# EAGLE design Qwiic-OpenLog (EAGLE 9.1.2)
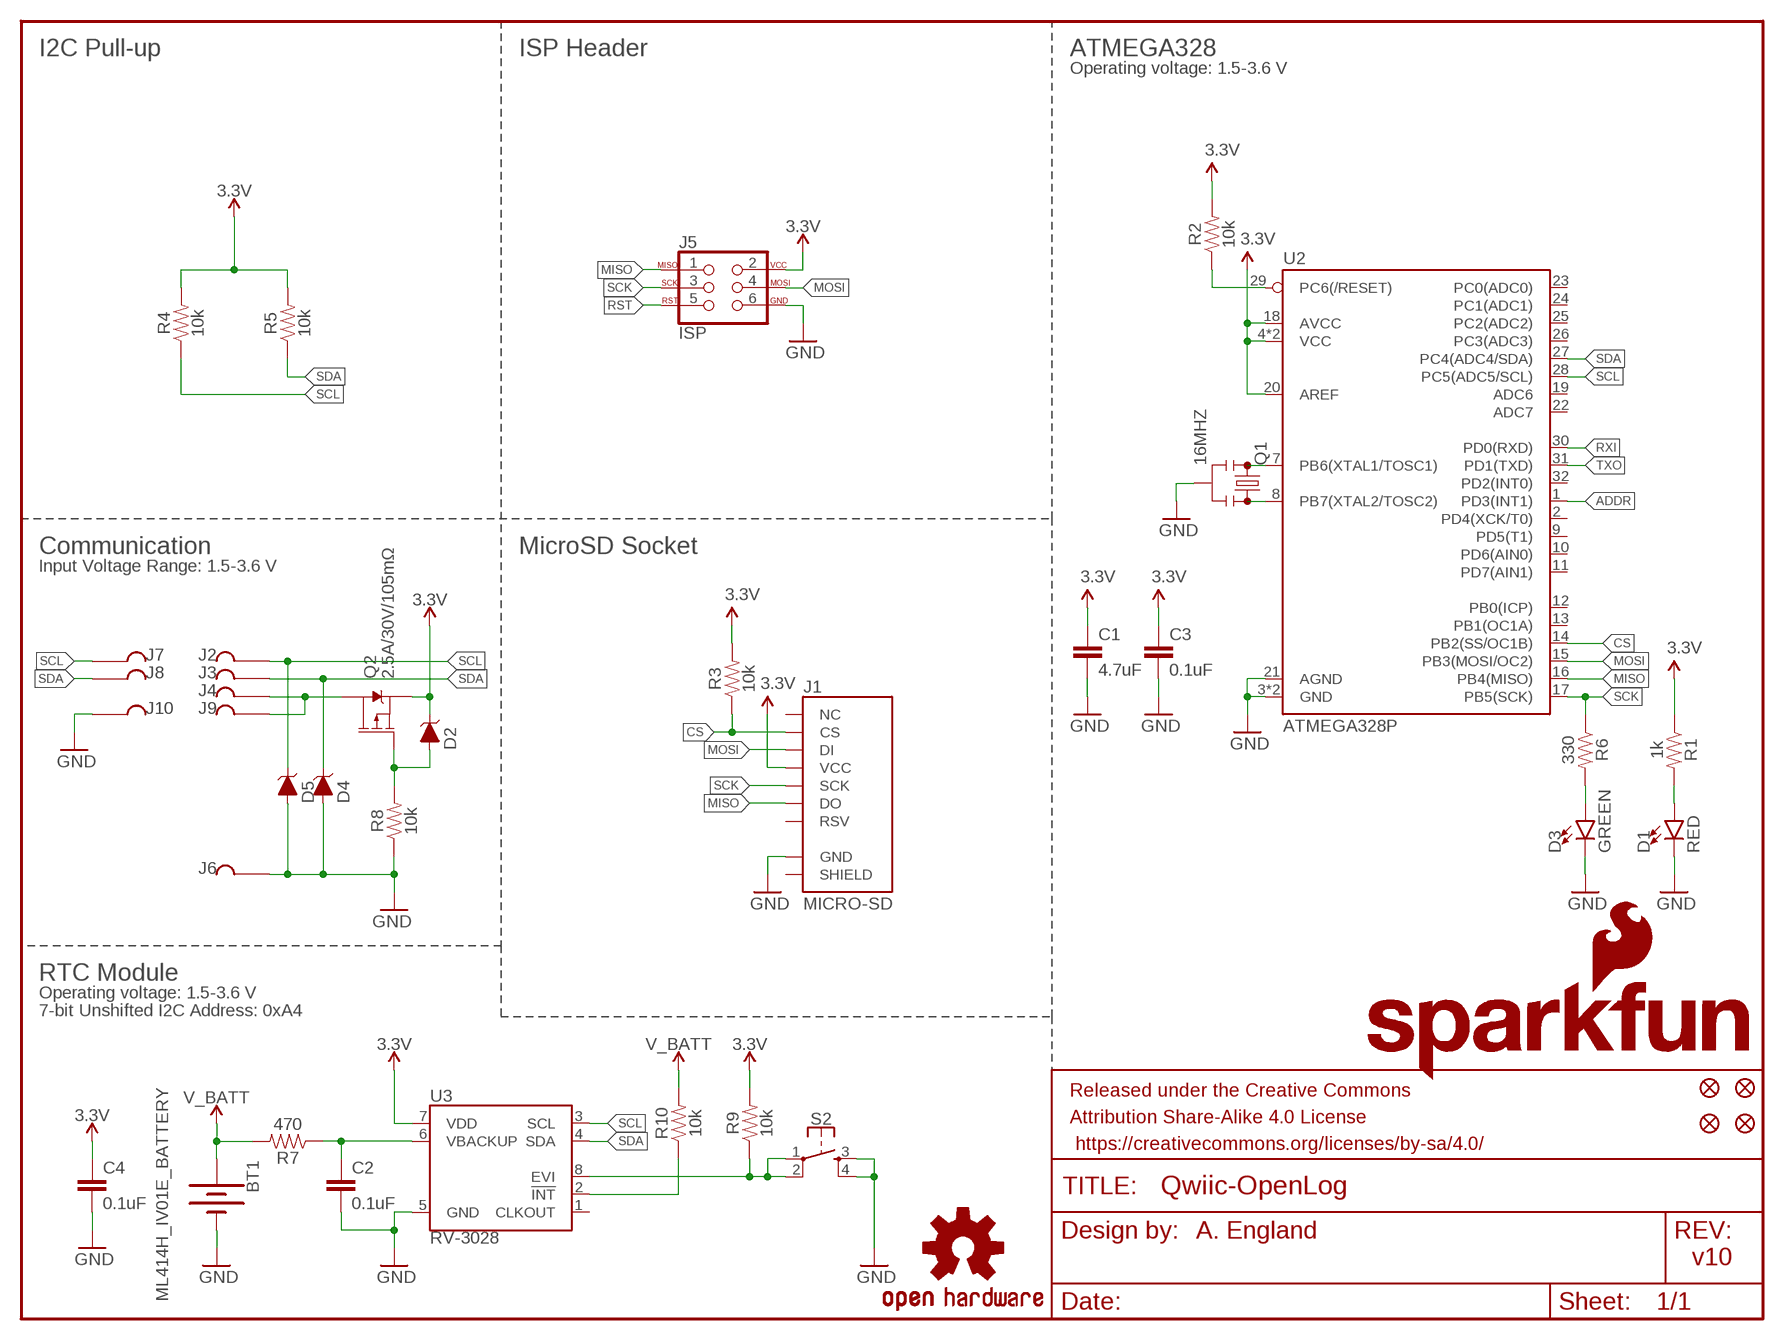
[diagram p0: schematic, sheet 1]

## Parts
BT1  ML414H_IV01E_BATTERY  [ML414H_IV01E]
C1  4.7uF  4.7UF-0603-6.3V-(10%)  [0603]
C2  0.1uF  0.1UF-0603-25V-(+80/-20%)  [0603]
C3  0.1uF  0.1UF-0603-25V-(+80/-20%)  [0603]
C4  0.1uF  0.1UF-0603-25V-(+80/-20%)  [0603]
D1  RED  LED-RED0603  [LED-0603]
D2  3.6V  DIODE-ZENER-BZT52C3V6S  [SOD-323]
D3  GREEN  LED-GREEN0603  [LED-0603]
D4  3.6V  DIODE-ZENER-BZT52C3V6S  [SOD-323]
D5  3.6V  DIODE-ZENER-BZT52C3V6S  [SOD-323]
FID1  FIDUCIALUFIDUCIAL  [FIDUCIAL-MICRO]
FID2  FIDUCIALUFIDUCIAL  [FIDUCIAL-MICRO]
FID3  FIDUCIALUFIDUCIAL  [FIDUCIAL-MICRO]
FID4  FIDUCIALUFIDUCIAL  [FIDUCIAL-MICRO]
FRAME1  FRAME-LETTER  [CREATIVE_COMMONS]
J1  MICRO-SD  MICRO-SD_CARD_SOCKETPUSH-PUSH  [MICRO-SD-SOCKET]
J2  GATORGATOR_MINI  [GATOR_MINI]
J3  GATORGATOR_MINI  [GATOR_MINI]
J4  GATORGATOR_MINI  [GATOR_MINI]
J5  ISP  AVR_SPI_PROG_3X2TESTPOINTS  [2X3_TEST_POINTS]
J6  GATORGATOR_MINI  [GATOR_MINI]
J7  GATORGATOR_MINI  [GATOR_MINI]
J8  GATORGATOR_MINI  [GATOR_MINI]
J9  GATORGATOR_MINI  [GATOR_MINI]
J10  GATORGATOR_MINI  [GATOR_MINI]
LOGO1  SFE_LOGO_FLAME.1_INCH  [SFE_LOGO_FLAME_.1]
LOGO2  OSHW-LOGOMINI  [OSHW-LOGO-MINI]
LOGO4  SFE_LOGO_NAME_FLAME.1_INCH  [SFE_LOGO_NAME_FLAME_.1]
Q1  16MHZ  RESONATOR16MHZ  [RESONATOR-SMD]
Q2  2.5A/30V/105mΩ  MOSFET_PCH-DMG2307L  [SOT23-3]
R1  1k  1KOHM-0603-1/10W-1%  [0603]
R2  10k  10KOHM-0603-1/10W-1%  [0603]
R3  10k  10KOHM-0603-1/10W-1%  [0603]
R4  10k  10KOHM-0603-1/10W-1%  [0603]
R5  10k  10KOHM-0603-1/10W-1%  [0603]
R6  330  330OHM-0603-1/10W-1%  [0603]
R7  470  470OHM-0603-1/10W-1%  [0603]
R8  10k  10KOHM-0603-1/10W-1%  [0603]
R9  10k  10KOHM-0603-1/10W-1%  [0603]
R10  10k  10KOHM-0603-1/10W-1%  [0603]
S2  MOMENTARY-SWITCH-SPST-2-SMD-5.2MM-TALL  [TACTILE_SWITCH_SMD_5.2MM]
U2  ATMEGA328P  ATMEGA328P_TQFP  [TQFP32-08]
U3  RV-3028  [RV-3028]

## Nets
3.3V: C1.1 C3.1 C4.1 D2.C J1.VCC J5.2 Q2.2(S) R1.1 R2.2 R3.2 R4.2 R5.2 R9.2 U2.4(VCC) U2.6(VCC) U2.18(AVCC) U2.20(AREF) U3.7(VDD)
!RST: R10.1 U3.2(!INT)
ADDR: U2.1(PD3(INT1))
CS: J1.CS R3.1 U2.14(PB2(SS/OC1B))
GND [vcc]: BT1.- C1.2 C2.2 C3.2 C4.2 D1.C D3.C D4.A D5.A J1.GND J5.6 J6.P$2 J10.P$2 Q1.2 R8.1 S2.3 S2.4 U2.3(GND) U2.5(GND) U2.21(AGND) U3.5(GND)
MISO: J1.DO J5.1 U2.16(PB4(MISO))
MOSI: J1.DI J5.4 U2.15(PB3(MOSI/OC2))
N$1: Q1.1 U2.8(PB7(XTAL2/TOSC2))
N$2: Q1.3 U2.7(PB6(XTAL1/TOSC1))
N$3: D1.A R1.2
N$5: J4.P$2 J9.P$2 Q2.3(D)
N$6: D2.A Q2.1(G) R8.2
N$7: D3.A R6.2
N$8: R9.1 S2.1 S2.2 U3.8(EVI)
RST: J5.5 R2.1 U2.29(PC6(/RESET))
RXI: U2.30(PD0(RXD))
SCK: J1.SCLK(SCK) J5.3 R6.1 U2.17(PB5(SCK))
SCL: D5.C J2.P$2 J7.P$2 R4.1 U2.28(PC5(ADC5/SCL)) U3.3(SCL)
SDA: D4.C J3.P$2 J8.P$2 R5.1 U2.27(PC4(ADC4/SDA)) U3.4(SDA)
TXO: U2.31(PD1(TXD))
V_BATT: BT1.+ R7.2 R10.2
VBACKUP: C2.1 R7.1 U3.6(VBACKUP)
Unconnected: J1.CD1(SHIELD) J1.RSV1(RSV) J1.RSV2(NC) U2.2(PD4(XCK/T0)) U2.9(PD5(T1)) U2.10(PD6(AIN0)) U2.11(PD7(AIN1)) U2.12(PB0(ICP)) U2.13(PB1(OC1A)) U2.19(ADC6) U2.22(ADC7) U2.23(PC0(ADC0)) U2.24(PC1(ADC1)) U2.25(PC2(ADC2)) U2.26(PC3(ADC3)) U2.32(PD2(INT0)) U3.1(CLKOUT)

## Notes on the sheet
- I2C Pull-up | ISP Header | ATMEGA328
- Operating voltage: 1.5-3.6 V
- Communication | MicroSD Socket
- Input Voltage Range: 1.5-3.6 V
- RTC Module
- Operating voltage: 1.5-3.6 V
- 7-bit Unshifted I2C Address: 0xA4
- A. England
- v10

## Library data of the parts
BT1 = SparkFun-Batteries:ML414H_IV01E_BATTERY: SEIKO ML414H-IV01E Reflowable Lithium Battery ML414H is a rechargeable, coin type battery with features such as Pb-free reflowable (Peak temperature: 260 C) and high temperature heat resistance. Battery Characteristics: 3.1V max voltage Voff is 2V 1mAH 3k series resistor with battery 72 hour charge time from 2.0-3.1V 2.3-2.8V initial charge; PROD_ID: BATT-14267
C1 = SparkFun-Capacitors:4.7UF: 4.7µF ceramic capacitors A capacitor is a passive two-terminal electrical component used to store electrical energy temporarily in an electric field.; PROD_ID: CAP-08280
C2-C4 = SparkFun-Capacitors:0.1UF: 0.1µF ceramic capacitors A capacitor is a passive two-terminal electrical component used to store electrical energy temporarily in an electric field.; PROD_ID: CAP-00810
D1 = SparkFun-LED:LED-RED: Red SMD LED Used in manufacturing of most products at SparkFun Packages: 0603 - SMD 0603 package [Product Link] <http://docs.avagotech.com/docs/AV02-0551EN> 0603 SMART - SMD 0603 SMART package ( more efficient and expensive)[Product Link] <http://www.osram-os.com/Graphics/XPic2/00077099_0.pdf> 1206 - SMD1206 package [Product Link] <https://www.sparkfun.com/datasheets/DevTools/LilyPad/Q150OVS4.pdff> SparkFun Products: Pro Mini 328 -5V <https://www.sparkfun.com/products/821> RedBoard <https://www.sparkfun.com/products/12757> IOIO-OTG <https://www.sparkfun.com/products/13613>; PROD_ID: DIO-00819
D2 D4 D5 = SparkFun-DiscreteSemi:DIODE-ZENER: Zener Diode A Zener diode allows current to flow from its anode to its cathode like a normal semiconductor diode, but it also permits current to flow in the reverse direction when its "Zener voltage" is reached. - WIkipedia; PROD_ID: DIO-08199
D3 = SparkFun-LED:LED-GREEN: Green SMD LED Used in manufacturing of various products at SparkFun Packages: 0603 - SMD 0603 package [Product Link] <http://www.futureelectronics.com/en/technologies/semiconductors/optoelectronics/leds/Pages/9894312-LTST-C190GKT.aspx?CrossPart=HSMG-C190&IM=0> LilyPad 1206 - SMD1206 LilyPad package [Product Link] <http://www.futureelectronics.com/en/Technologies/Product.aspx?ProductID=IN150NGHARVATEKCORPORATION2049943&IM=0> 1206 - SMD1206 package [Product Link] <http://www.futureelectronics.com/en/technologies/semiconductors/optoelectronics/leds/Pages/8315665-LTST-C150KGKT.aspx?IM=0> 1206 Bottom Mount -SMD 1206 Bottom Mount [Product Link] <http://www.digikey.com/product-detail/en/lite-on-inc/LTST-C230KGKT/160-1456-1-ND/386854> SparkFun Products: Pro Mini 328 -5V <https://www.sparkfun.com/products/821> RedBoard <https://www.sparkfun.com/products/12757> MP3 Trigger <https://www.sparkfun.com/products/13720> Makey Makey <https://www.sparkfun.com/products/11076>; PROD_ID: DIO-00821
FID1-FID4 = SparkFun-Aesthetics:FIDUCIAL: Fiducial Alignment Points Point-of-reference for pick-and-place machines and other optical instruments.
FRAME1 = SparkFun-Aesthetics:FRAME-LETTER: Schematic Frame - Letter Standard 8.5x11 US Letter frame
J1 = SparkFun-Connectors:MICRO-SD_CARD_SOCKET: microSD Socket for Transflash Push-push type µSD socket. tDoc lines correctly indicate media card edge positions when inserting (unlocked, locked, depressed). NOTE: CD1 and CD2 are connected internally, and the default detect state of the socket is detect pin to ground. SparkFun Products: WAV Trigger <https://www.sparkfun.com/products/13660> CAN-Bus Shield <https://www.sparkfun.com/products/13262> SparkFun Level Shifing microSD Breakout <https://www.sparkfun.com/products/13743>; PROD_ID: CONN-07820
J2-J4 J6-J10 = SparkFun-Connectors:GATOR
J5 = SparkFun-Connectors:AVR_SPI_PROG_3X2: AVR ISP 6 Pin This is the reduced ISP connector for AVR programming. Common on Arduino. This footprint will take up less PCB space and can be used with a 10-pin to 6-pin adapter such as SKU: BOB-08508 **Special note about "TEST_POINT" package. The stop mask is on the top side, so if you want your programming test points to be on the bottom of your board, make sure to place this package on the bottom side of the board. This also ensure that the orientation to program from the bottom side will be correct. SparkFun Products: SparkFun ISP Pogo Adapter <https://www.sparkfun.com/products/11591> - NS Tiny AVR Programmer <https://www.sparkfun.com/products/11801> -PTH
LOGO1 = SparkFun-Aesthetics:SFE_LOGO_FLAME: SparkFun Flame Logo This is the SparkFun flame logo. The logo on the schematic will always be the same size; the package variant is the height of the flame. Default layer for the logo on the board is tSilk.
LOGO2 = SparkFun-Aesthetics:OSHW-LOGO: Open-Source Hardware (OSHW) Logo This logo indicates the piece of hardware it is found on incorporates a OSHW license and/or adheres to the definition of open source hardware found here: http://freedomdefined.org/OSHW
LOGO4 = SparkFun-Aesthetics:SFE_LOGO_NAME_FLAME: SparkFun Font Logo w/ Flame This is the SparkFun full logo. The logo on the schematic will always be the same size; the package variant is the height of the flame part of the logo. Default layer for the logo on the board is tSilk.
Q1 = SparkFun-FreqCtrl:RESONATOR: Resonator Small SMD resonator. Used, eg, on the Arduino Pro/ Pro Mini boards. 8MHz- XTAL-08895 16MHz- XTAL-08900; PROD_ID: XTAL-08900
Q2 = SparkFun-DiscreteSemi:MOSFET_PCH: P-channel MOSFETs Voltage controlled devices that allow control of high current outputs. SparkFun Products: SparkFun ESP32 Thing <https://www.sparkfun.com/products/13907> SparkFun ESP8266 Thing <https://www.sparkfun.com/products/13231>; PROD_ID: TRANS-11308
R1 = SparkFun-Resistors:1KOHM: 1kΩ resistor A resistor is a passive two-terminal electrical component that implements electrical resistance as a circuit element. Resistors act to reduce current flow, and, at the same time, act to lower voltage levels within circuits. - Wikipedia; PROD_ID: RES-07856
R2-R5 R8-R10 = SparkFun-Resistors:10KOHM: 10kΩ resistor A resistor is a passive two-terminal electrical component that implements electrical resistance as a circuit element. Resistors act to reduce current flow, and, at the same time, act to lower voltage levels within circuits. - Wikipedia; PROD_ID: RES-00824
R6 = SparkFun-Resistors:330OHM: 330Ω resistor A resistor is a passive two-terminal electrical component that implements electrical resistance as a circuit element. Resistors act to reduce current flow, and, at the same time, act to lower voltage levels within circuits. - Wikipedia; PROD_ID: RES-00818
R7 = SparkFun-Resistors:470OHM: 470Ω resistor A resistor is a passive two-terminal electrical component that implements electrical resistance as a circuit element. Resistors act to reduce current flow, and, at the same time, act to lower voltage levels within circuits. - Wikipedia; PROD_ID: RES-07869
S2 = SparkFun-Switches:MOMENTARY-SWITCH-SPST-2: Momentary Switch (Pushbutton) - SPST - Two Circuits Normally-open (NO) SPST momentary switches (buttons, pushbuttons). Schematic symbol includes two switch circuits. Variants SMD-4.6MMX2.8MM - 4.60mm x 2.80mm Tactile Momentary Button Switch - Used on SparkFun SAMD21 Mini Breakout <https://www.sparkfun.com/products/13664> SMD-5.2MM - Mini Pushbutton Switch - SMD <https://www.sparkfun.com/products/8720> - Used on Arduino Pro Mini <https://www.sparkfun.com/products/11114>; PROD_ID: SWCH-14139
U2 = SparkFun-IC-Microcontroller:ATMEGA328P_TQFP: Popular 328P in QFP Storefront component: ATmega328 - TQFP <https://www.sparkfun.com/products/13448> (COM-13448) Datasheet <http://www.sparkfun.com/datasheets/Components/SMD/ATMega328.pdf> SparkFun Products SparkFun RedBoard - Programmed with Arduino <https://www.sparkfun.com/products/12757> (DEV-12757) Arduino Pro Mini 328 - 5V/16MHz <https://www.sparkfun.com/products/11113> (DEV-11113) Arduino Pro Mini 328 - 3.3V/8MHz <https://www.sparkfun.com/products/11114> (DEV-11114) SparkFun OpenLog <https://www.sparkfun.com/products/13712> (DEV-13712) SparkFun MicroView - OLED Arduino Module <https://www.sparkfun.com/products/12923> (DEV-12923) SparkFun Digital Sandbox <https://www.sparkfun.com/products/12651> (DEV-12651) SparkFun PicoBoard <https://www.sparkfun.com/products/11888> (WIG-11888) Arduino Fio <https://www.sparkfun.com/products/10116> (DEV-10116) LilyPad Arduino 328 Main Board <https://www.sparkfun.com/products/13342> (DEV-13342) SparkFun RedStick <https://www.sparkfun.com/products/13741> (DEV-13741) LilyPad MP3 <https://www.sparkfun.com/products/11013> (DEV-11013) LilyPad Arduino SimpleSnap <https://www.sparkfun.com/products/10941> (DEV-10941) SparkFun Stepoko <https://www.sparkfun.com/products/13899> (ROB-13899) SparkFun Geiger Counter <https://www.sparkfun.com/products/11345> (SEN-11345) SparkFun EL Sequencer <https://www.sparkfun.com/products/12781> (COM-12781) Arduino Pro 328 - 5V/16MHz <https://www.sparkfun.com/products/10915> (DEV-10915) CryptoCape <https://www.sparkfun.com/products/12773> (DEV-12773) SparkFun IR Thermometer Evaluation Board - MLX90614 <https://www.sparkfun.com/products/10740> (SEN-10740) SparkFun RedBot Mainboard <https://www.sparkfun.com/products/12097> (ROB-12097) Arduino Pro 328 - 3.3V/8MHz <https://www.sparkfun.com/products/10914> (DEV-10914) SparkFun Block for Intel® Edison - Arduino <https://www.sparkfun.com/products/13036> (DEV-13036) SparkFun Simon Says - Surface Mount Soldering Kit <https://www.sparkfun.com/products/10935> (KIT-10935) SparkFun 7-Segment Serial Display - Red <https://www.sparkfun.com/products/11441> (COM-11441) SparkFun 7-Segment Serial Display - White <https://www.sparkfun.com/products/11629> (COM-11629) SparkFun 7-Segment Serial Display - Yellow <https://www.sparkfun.com/products/11443> (COM-11443) SparkFun 7-Segment Serial Display - Kelly Green <https://www.sparkfun.com/products/11440> (COM-11440) SparkFun 7-Segment Serial Display - Blue <https://www.sparkfun.com/products/11442> (COM-11442) SparkFun OpenSegment Serial Display - 20mm (Blue) <https://www.sparkfun.com/products/11647> (COM-11647) SparkFun OpenSegment Serial Display - 20mm (Green) <https://www.sparkfun.com/products/11646> (COM-11646) SparkFun OpenSegment Serial Display - 20mm (White) <https://www.sparkfun.com/products/11648> (COM-11648) SparkFun OpenSegment Serial Display - 20mm (Red) <https://www.sparkfun.com/products/11644> (COM-11644) SparkFun OpenSegment Serial Display - 20mm (Yellow) <https://www.sparkfun.com/products/11645> (COM-11645) SparkFun OpenSegment Shield <https://www.sparkfun.com/products/13190> (DEV-13190); PROD_ID: IC-09069; VALUE: ATMEGA328P_TQFP
U3 = SparkFun-Clocks:RV-3028: RV-3028 - RTC with I2C Bus Specifications: Pin count: 8 Pin pitch: .9mm Area: [3.2mm x 2.0mm] Datasheet referenced for footprint <https://www.microcrystal.com/fileadmin/Media/Products/RTC/App.Manual/RV-3028-C7_App-Manual.pdf>; PROD_ID: IC-14378

## Net classes
1 vcc: width 0.152 mm

## Board
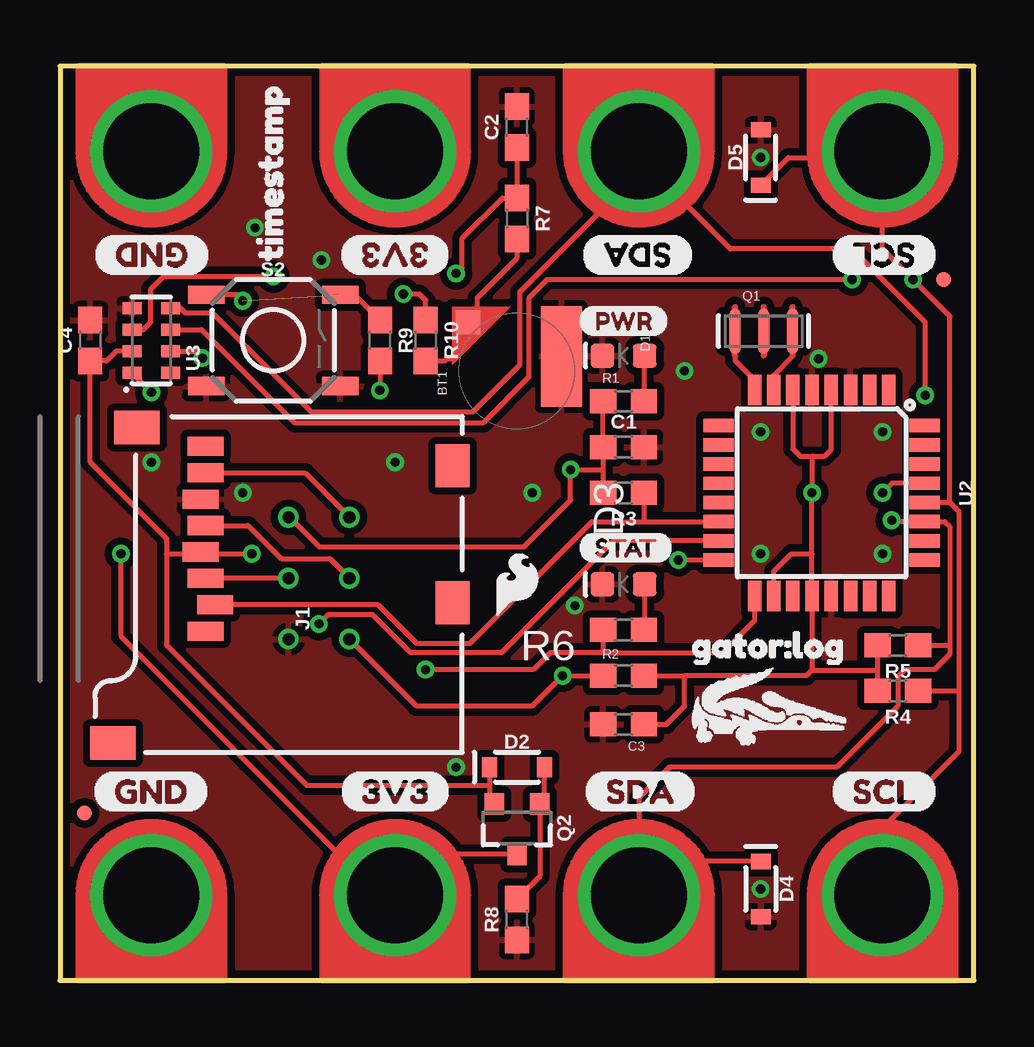
[diagram p1: board, top side]
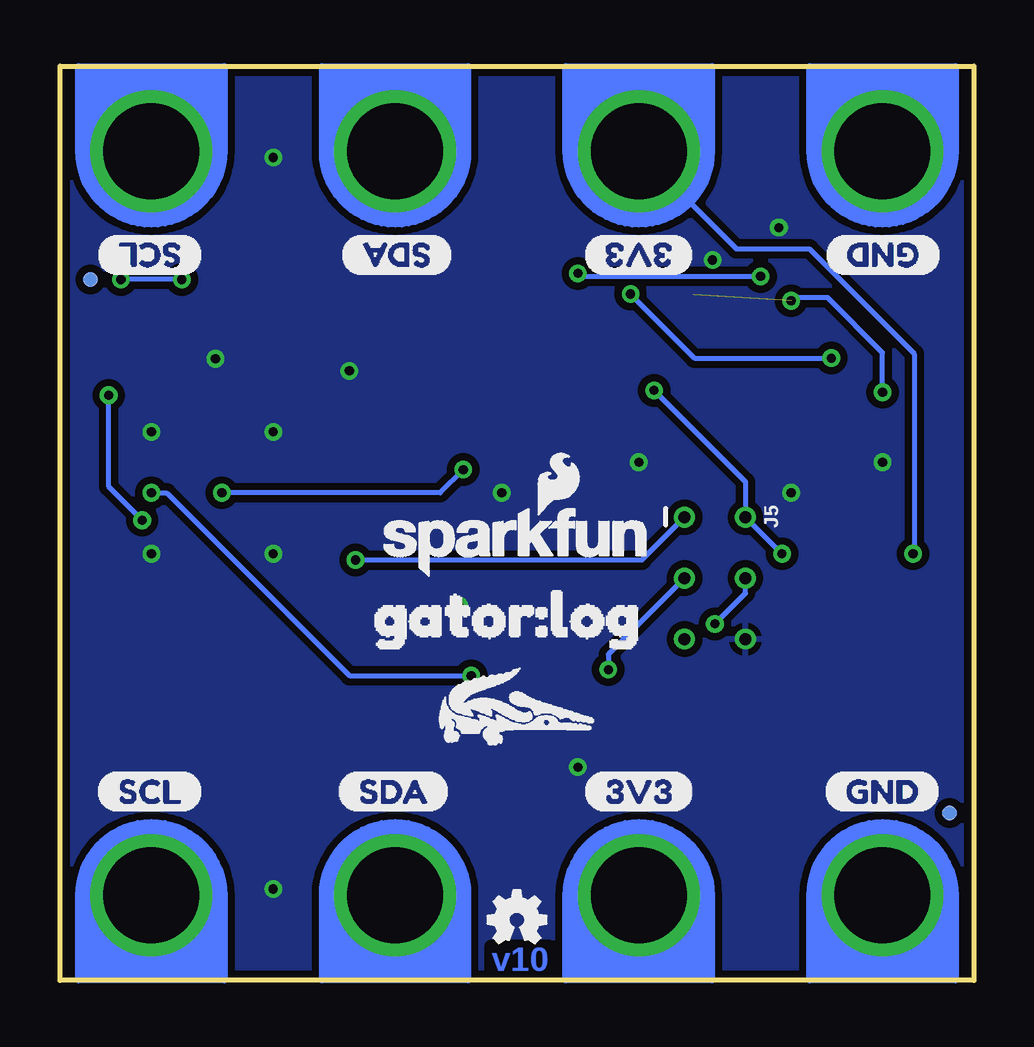
[diagram p2: board, bottom side, seen from below]

Size 38.1 x 38.1 mm. Coordinates in mm from the lower left corner, seen from the top.
Outline: 38.1,0 38.1,38.1 0,38.1 0,0 38.1,0
Copper layers (1*16): Top 0.035mm / dielectric 1.5mm / Bottom 0.035mm
Design rules "SparkFun-2-layer-TIGHT": minimum track width 7mil, minimum drill 15mil, track to track 7mil, track to pad 7mil, pad to pad 7mil, via to via 7mil, smd to smd 7mil, copper to edge 7mil, drill to drill 7mil, minimum pad ring 7mil, minimum via ring 7mil, stop-mask expansion 4mil, vias tented up to drill 25mil, thermal gap 10mil

### Footprints (pad centres in the part's own frame; a part is rotated, then mirrored left to right if it is on the bottom)
ML414H_IV01E = smd 1 x 1: + 2.022,2.032 | smd 4.2 x 1.7: - 0.6,-1.85
0603 = smd 1.1 x 1: 1 -0.85,0; 2 0.85,0
LED-0603 = smd 1 x 1: A -0.877,0; C 0.877,0
SOD-323 = smd 0.63 x 0.83: A 1.15,0; C -1.15,0
FIDUCIAL-MICRO = smd 0.635 x 0.635: 1 0,0
MICRO-SD-SOCKET = smd 1.8 x 1.4: CD1 -2.05,0.4; CD2 -7.75,0.4 | smd 0.8 x 1.5: CS -7.84,10.3; DI -6.74,10.7; DO -2.34,10.7; GND -3.44,10.9; RSV1 -8.94,10.7; RSV2 -1.24,10.7; SCLK -4.54,10.7; VCC -5.64,10.9 | smd 1.4 x 1.9: GND1 -13.6,14.55; GND3 -0.45,13.55
GATOR_MINI = drill 4 pad 5.08: P$2 0,-0.254
2X3_TEST_POINTS = drill 0.508: 1 -2.54,-1.27; 2 -2.54,1.27; 3 0,-1.27; 4 0,1.27; 5 2.54,-1.27; 6 2.54,1.27
RESONATOR-SMD = smd 0.45 x 1.905: 1 -1.2,0; 2 0,0; 3 1.2,0
SOT23-3 = smd 0.8 x 0.9: 1 -0.95,-1; 2 0.95,-1; 3 0,1.1
TACTILE_SWITCH_SMD_5.2MM = smd 1.524 x 0.762: 1 -2.794,1.905; 2 2.794,1.905; 3 -2.794,-1.905; 4 2.794,-1.905
TQFP32-08 = smd 1.27 x 0.559: 1 -4.293,2.8; 2 -4.293,2; 3 -4.293,1.2; 4 -4.293,0.4; 5 -4.293,-0.4; 6 -4.293,-1.2; 7 -4.293,-2; 8 -4.293,-2.8; 17 4.293,-2.8; 18 4.293,-2; 19 4.293,-1.2; 20 4.293,-0.4; 21 4.293,0.4; 22 4.293,1.2; 23 4.293,2; 24 4.293,2.8 | smd 0.559 x 1.27: 9 -2.8,-4.293; 10 -2,-4.293; 11 -1.2,-4.293; 12 -0.4,-4.293; 13 0.4,-4.293; 14 1.2,-4.293; 15 2,-4.293; 16 2.8,-4.293; 25 2.8,4.293; 26 2,4.293; 27 1.2,4.293; 28 0.4,4.293; 29 -0.4,4.293; 30 -1.2,4.293; 31 -2,4.293; 32 -2.8,4.293
RV-3028 = smd 0.5 x 0.8: 1 -1.35,-0.8; 2 -0.45,-0.8; 3 0.45,-0.8; 4 1.35,-0.8; 5 1.35,0.8; 6 0.45,0.8; 7 -0.45,0.8; 8 -1.35,0.8

### Placement (x,y rotation side)
BT1  19.05,25.4 90 top
C1  23.5,22.23 0 top
C2  19.05,35.56 90 top
C3  23.5,10.67 180 top
C4  1.27,26.67 90 top
D1  23.5,26.04 180 top
D2  19.05,8.89 0 top
D3  23.5,16.51 180 top
D4  29.21,3.81 270 top
D5  29.21,34.29 90 top
FID1  36.83,29.21 0 top
FID2  1.02,6.99 0 top
FID3  1.02,6.99 180 bottom
FID4  36.83,29.21 0 bottom
FRAME1  -21.06,-15.24 0 top  (outside the outline)
J1  16.76,23.5 90 top
J2  34.29,34.29 180 top
J3  24.13,34.29 180 top
J4  13.97,34.29 180 top
J5  10.79,16.76 270 bottom
J6  3.81,34.29 180 top
J7  34.29,3.81 0 top
J8  24.13,3.81 0 top
J9  13.97,3.81 0 top
J10  3.81,3.81 0 top
LOGO1  19.05,16.51 0 top
LOGO2  19.05,2.54 0 bottom
LOGO4  19.05,18.29 0 bottom
Q1  29.34,27.05 0 top
Q2  19.05,6.35 180 top
R1  23.5,24.13 0 top
R2  23.5,12.7 0 top
R3  23.5,20.32 180 top
R4  34.92,12.06 180 top
R5  34.92,13.97 180 top
R6  23.5,14.61 0 top
R7  19.05,31.75 270 top
R8  19.05,2.54 90 top
R9  13.34,26.67 270 top
R10  15.24,26.67 270 top
S2  8.89,26.67 0 top
U2  31.75,20.32 270 top
U3  3.81,26.67 90 top
U$1  [3V33]  11.63,7.87 0 top
U$2  [GND0]  1.37,7.87 0 top
U$3  [3V33]  16.31,30.23 180 top
U$4  [SDA1]  21.84,7.87 0 top
U$5  [SCL2]  32.13,7.87 0 top
U$6  [SCL2]  36.58,30.23 180 top
U$7  [SDA1]  26.42,30.23 180 top
U$8  [GATORBIT_FINAL_FOR_SILK#01#PNG]  19.05,11.43 0 bottom
U$9  [PWR-()-03]  21.62,27.48 0 top
U$10  [GND0]  6.25,30.23 180 top
U$11  [GND0]  1.37,30.23 180 bottom
U$12  [3V33]  11.63,30.23 180 bottom
U$13  [SDA1]  21.72,30.23 180 bottom
U$14  [SCL2]  32.13,30.23 180 bottom
U$15  [3V33]  16.31,7.87 0 bottom
U$16  [SDA1]  26.54,7.87 0 bottom
U$17  [STAT0]  21.59,18.03 0 top
U$18  [SCL2]  36.58,7.87 0 bottom
U$19  [TIMESTAMP0]  8.76,29.08 90 top
U$20  [GATOR#LOG3]  25.4,13.97 0 top
U$21  [GATORBIT_FINAL_FOR_SILK#01#PNG]  29.59,11.43 0 top
U$22  [ORDERING_INSTRUCTIONS]  -10.16,-24.13 0 top  (outside the outline)
U$23  [GND0]  6.25,7.87 0 bottom
U$24  [GATOR#LOG0]  26.67,15.24 0 bottom

### Tracks (layer width: path | path; a pad name or v marks a point on that pad's centre or on a via)
3.3V  (via drill 0.38)
  Top 0.203: U2.6 30.55,22.16 30.86,21.84 31.37,21.84 | 31.37,21.84 31.88,21.84 32.15,22.12 U2.4 | 31.35,17.78 U2.20 31.35,12.94 | 31.35,17.78 v31.35,20.32 31.35,21.82 31.37,21.84 | R2.2 26.04,12.7 | J1.VCC 5.94,17.78 | 5.94,17.78 v8,17.78 | U2.18 29.75,17.05 30.48,17.78 31.35,17.78 | 22.64,21.34 C1.1 R1.1 | 22.64,21.34 R3.2 | J5.2 9.58,19.3 10.82,18.06 19.33,18.06 21.29,20.02 v21.29,21.29 22.59,21.29 22.64,21.34 | 4.45,17.78 5.94,17.78 | 4.45,17.78 4.45,18.41 1.27,21.59 C4.1 1.94,25.82 2.34,26.22 U3.7 | C3.1 25.27,10.67 26.04,11.43 26.04,12.7 | R5.2 34.08,12.95 | 34.08,12.95 R4.2 | 31.35,12.94 31.11,12.7 26.04,12.7 | 4.45,17.78 4.45,13.97 10.29,8.13 17.9,8.13 | 34.08,12.95 34.06,12.94 31.35,12.94 | R9.2 v13.34,24.59 | D2.C 17.9,8.13 | 17.9,8.13 17.9,7.55 Q2.2
  Bottom 0.203: v8,17.78 J5.2 9.53,20.78 v13.34,24.59 | v21.29,21.29 22.25,20.32 v31.35,20.32
!RST  (via drill 0.38)
  Top 0.203: U3.2 5.66,26.22 v5.94,25.93 | R10.1 15.24,28.35 14.98,28.6 v14.31,28.6
  Bottom 0.203: v14.31,28.6 11.64,25.93 v5.94,25.93
CS
  Top 0.203: J1.CS 13.25,15.65 14.86,14.05 17.09,14.05 22.17,19.12 24.34,19.12 | 24.34,19.12 U2.14 | R3.1 24.34,19.12
GND  (via drill 0.38)
  other vias: 10.9,30.02 16.51,8.89 21.46,15.62 19.68,20.32 7.62,20.32 13.97,21.59 26.04,25.4 31.62,25.91 8.13,31.37 29.21,3.81 29.21,22.86 29.21,17.78 34.29,17.78 34.29,22.86 3.81,21.59 29.21,34.29
  pour Top (isolate 0.305): 38.1,0 0,0 0,38.1 38.1,38.1
  pour Bottom (isolate 0.305): 38.1,0 0,0 0,38.1 38.1,38.1
MISO  (via drill 0.38)
  Top 0.203: U2.16 v25.77,17.52 | J1.DO 10.21,21.16 J5.1
  Bottom 0.203: v25.77,17.52 13.84,17.52 13.84,17.53 J5.1
MOSI  (via drill 0.38)
  Top 0.203: J5.4 9.52,16.75 J1.DI | v10.79,14.86 11.19,15.25 13.02,15.25 14.61,13.66 18.41,13.66 23.07,18.32 U2.15
  Bottom 0.203: v10.79,14.86 9.53,16.13 J5.4
N$1
  Top 0.203: Q1.1 28.14,25.84 28.95,25.02 U2.8
N$2
  Top 0.203: Q1.3 30.54,26.02 29.75,25.23 U2.7
N$3
  Top 0.203: D1.A 24.34,26.01 R1.2
N$5  (via drill 0.38)
  Top 0.203: v2.54,17.78 2.54,14.35 7.81,9.08 13.21,3.68 14.1,3.68 | Q2.3 15.66,5.25 14.1,3.68 | 14.1,3.68 J9.P$2
  Bottom 0.203: J4.P$2 9.91,30.48 6.86,30.48 2.49,26.11 2.49,17.83 v2.54,17.78
N$6
  Top 0.203: R8.2 20,4.34 Q2.1 20.2,7.55 D2.A
N$7
  Top 0.203: D3.A 24.37,14.63 R6.2
N$8  (via drill 0.38)  (1 unrouted)
  Top 0.203: R9.1 12.28,28.57 S2.2 | S2.1 | U3.8 v3.81,24.51 | v7.62,28.32 7.37,28.57 S2.1
  Bottom 0.203: v3.81,24.51 3.81,26.16 6.1,28.45 7.49,28.45 v7.62,28.32
RST  (via drill 0.38)
  Top 0.203: U2.29 34.69,20.72 v34.29,20.32 | R2.1 v20.95,12.7 19.68,11.43 14.86,11.43 J5.5
  Bottom 0.203: v34.29,20.32 33.66,20.32 26.04,12.7 v20.95,12.7
SCK  (via drill 0.38)
  Top 0.203: J1.SCLK 7.84,18.95 9.22,17.58 11.25,17.58 J5.3 | U2.17 28.95,14.98 27.64,13.66 22.61,13.66 | v15.24,12.95 19.74,12.95 20.45,13.66 22.61,13.66 | R6.1 22.64,13.7 22.61,13.66
  Bottom 0.203: J5.3 15.24,13.59 v15.24,12.95
SCL  (via drill 0.38)
  Top 0.203: 34.29,34.29 34.29,30.48 v35.56,29.21 37.1,27.67 37.1,19.92 | 34.29,34.29 J2.P$2 | U2.28 37.1,19.92 | 37.1,19.92 37.47,19.56 37.47,12.06 | v33.02,29.21 20.32,29.21 19.56,28.45 19.56,25.15 17.65,23.24 9.78,23.24 5.9,27.12 U3.3 | 37.47,12.06 37.47,9.53 34.29,6.35 J7.P$2 | R4.1 37.47,12.06 | D5.C 30.36,34.29 34.29,34.29
  Bottom 0.203: v33.02,29.21 v35.56,29.21
SDA  (via drill 0.38)
  Top 0.203: v34.67,19.18 34.73,19.12 U2.27 36.89,19.12 37.08,18.92 37.08,13.97 | v36.07,24.38 36.07,27.43 33.02,30.48 27.94,30.48 24.13,34.29 | 24.13,34.29 J3.P$2 | 37.08,13.97 37.08,13.59 36.45,12.95 35.22,12.95 34.92,12.66 34.92,11.43 32.38,8.89 25.4,8.89 24.13,7.62 24.13,5.08 | R5.1 37.08,13.97 | 24.13,34.29 24.13,33.66 19.18,28.7 19.18,25.65 17.22,23.7 10.46,23.7 6.35,27.81 5.23,27.81 5.02,28.02 U3.4 | 24.13,5.08 J8.P$2 | D4.C 24.25,4.96 24.13,5.08
  Bottom 0.203: v34.67,19.18 36.07,20.57 v36.07,24.38
V_BATT
  Top 0.203: R7.2 19.05,30.1 17.4,28.45 17.4,27.8 BT1.+ 17.02,26.54 16.38,25.91 16.13,25.91 16.04,25.82 R10.2
VBACKUP  (via drill 0.38)
  Top 0.203: v16.51,29.46 16.76,29.72 16.76,30.92 18.44,32.6 R7.1 C2.1 | U3.6 3.47,27.12 3.79,27.43 3.79,28.8 4.32,29.34 8.13,29.34 v8.89,29.34
  Bottom 0.203: v16.51,29.46 16.38,29.34 v8.89,29.34

### Text on the board
Bottom: v10
tValues: Qwiic | Qwiic
Measures: Units in Inches
tDocu: A. England | Black Gloss Soldermask